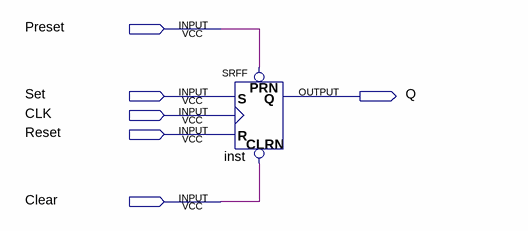
[diagram p0: schematic sheet]
// Quartus schematic RS_FlipFlop.bdf as structural Verilog: 1 symbols, 6 pins
module RS_FlipFlop (
  input  Preset,
  input  Set,
  input  CLK,
  input  Reset,
  input  Clear,
  output Q
);

  SRFF inst (.PRN(Preset), .CLRN(Clear), .S(Set), .R(Reset), .CLK(CLK), .Q(Q));
endmodule
